# EAGLE schematic io-board-a-1 (EAGLE 8.4.3)
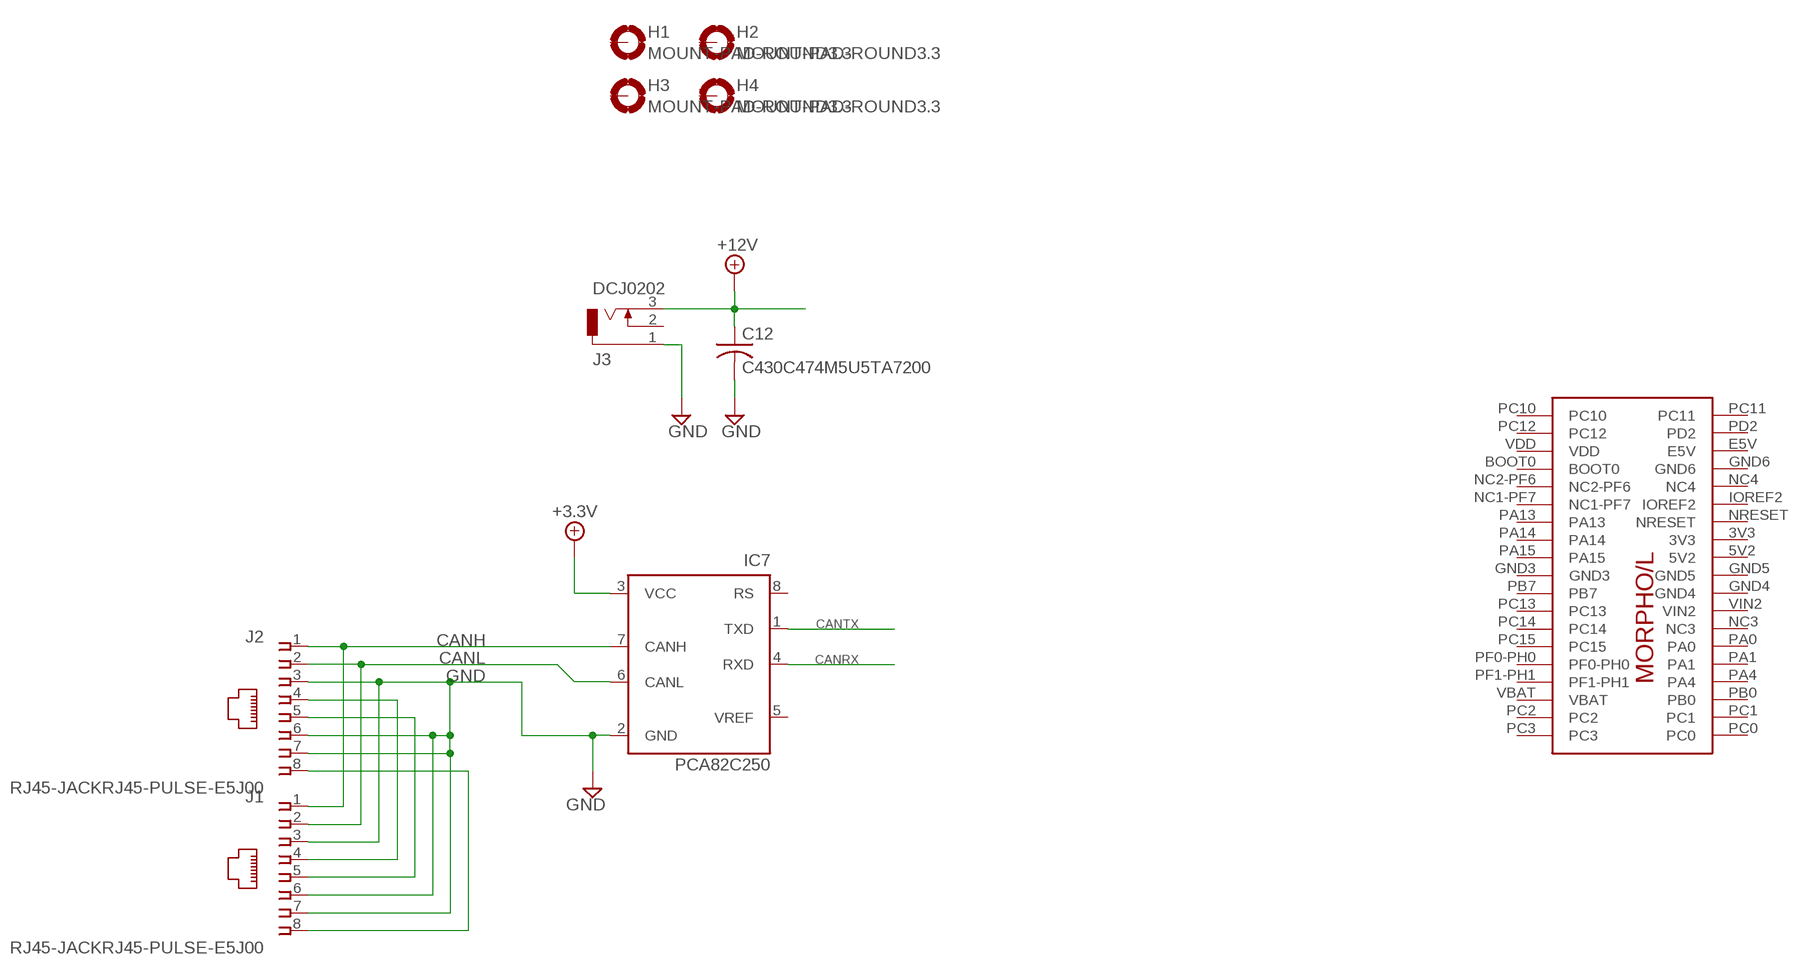
[diagram p0: schematic, sheet 1, part 1 of 2]
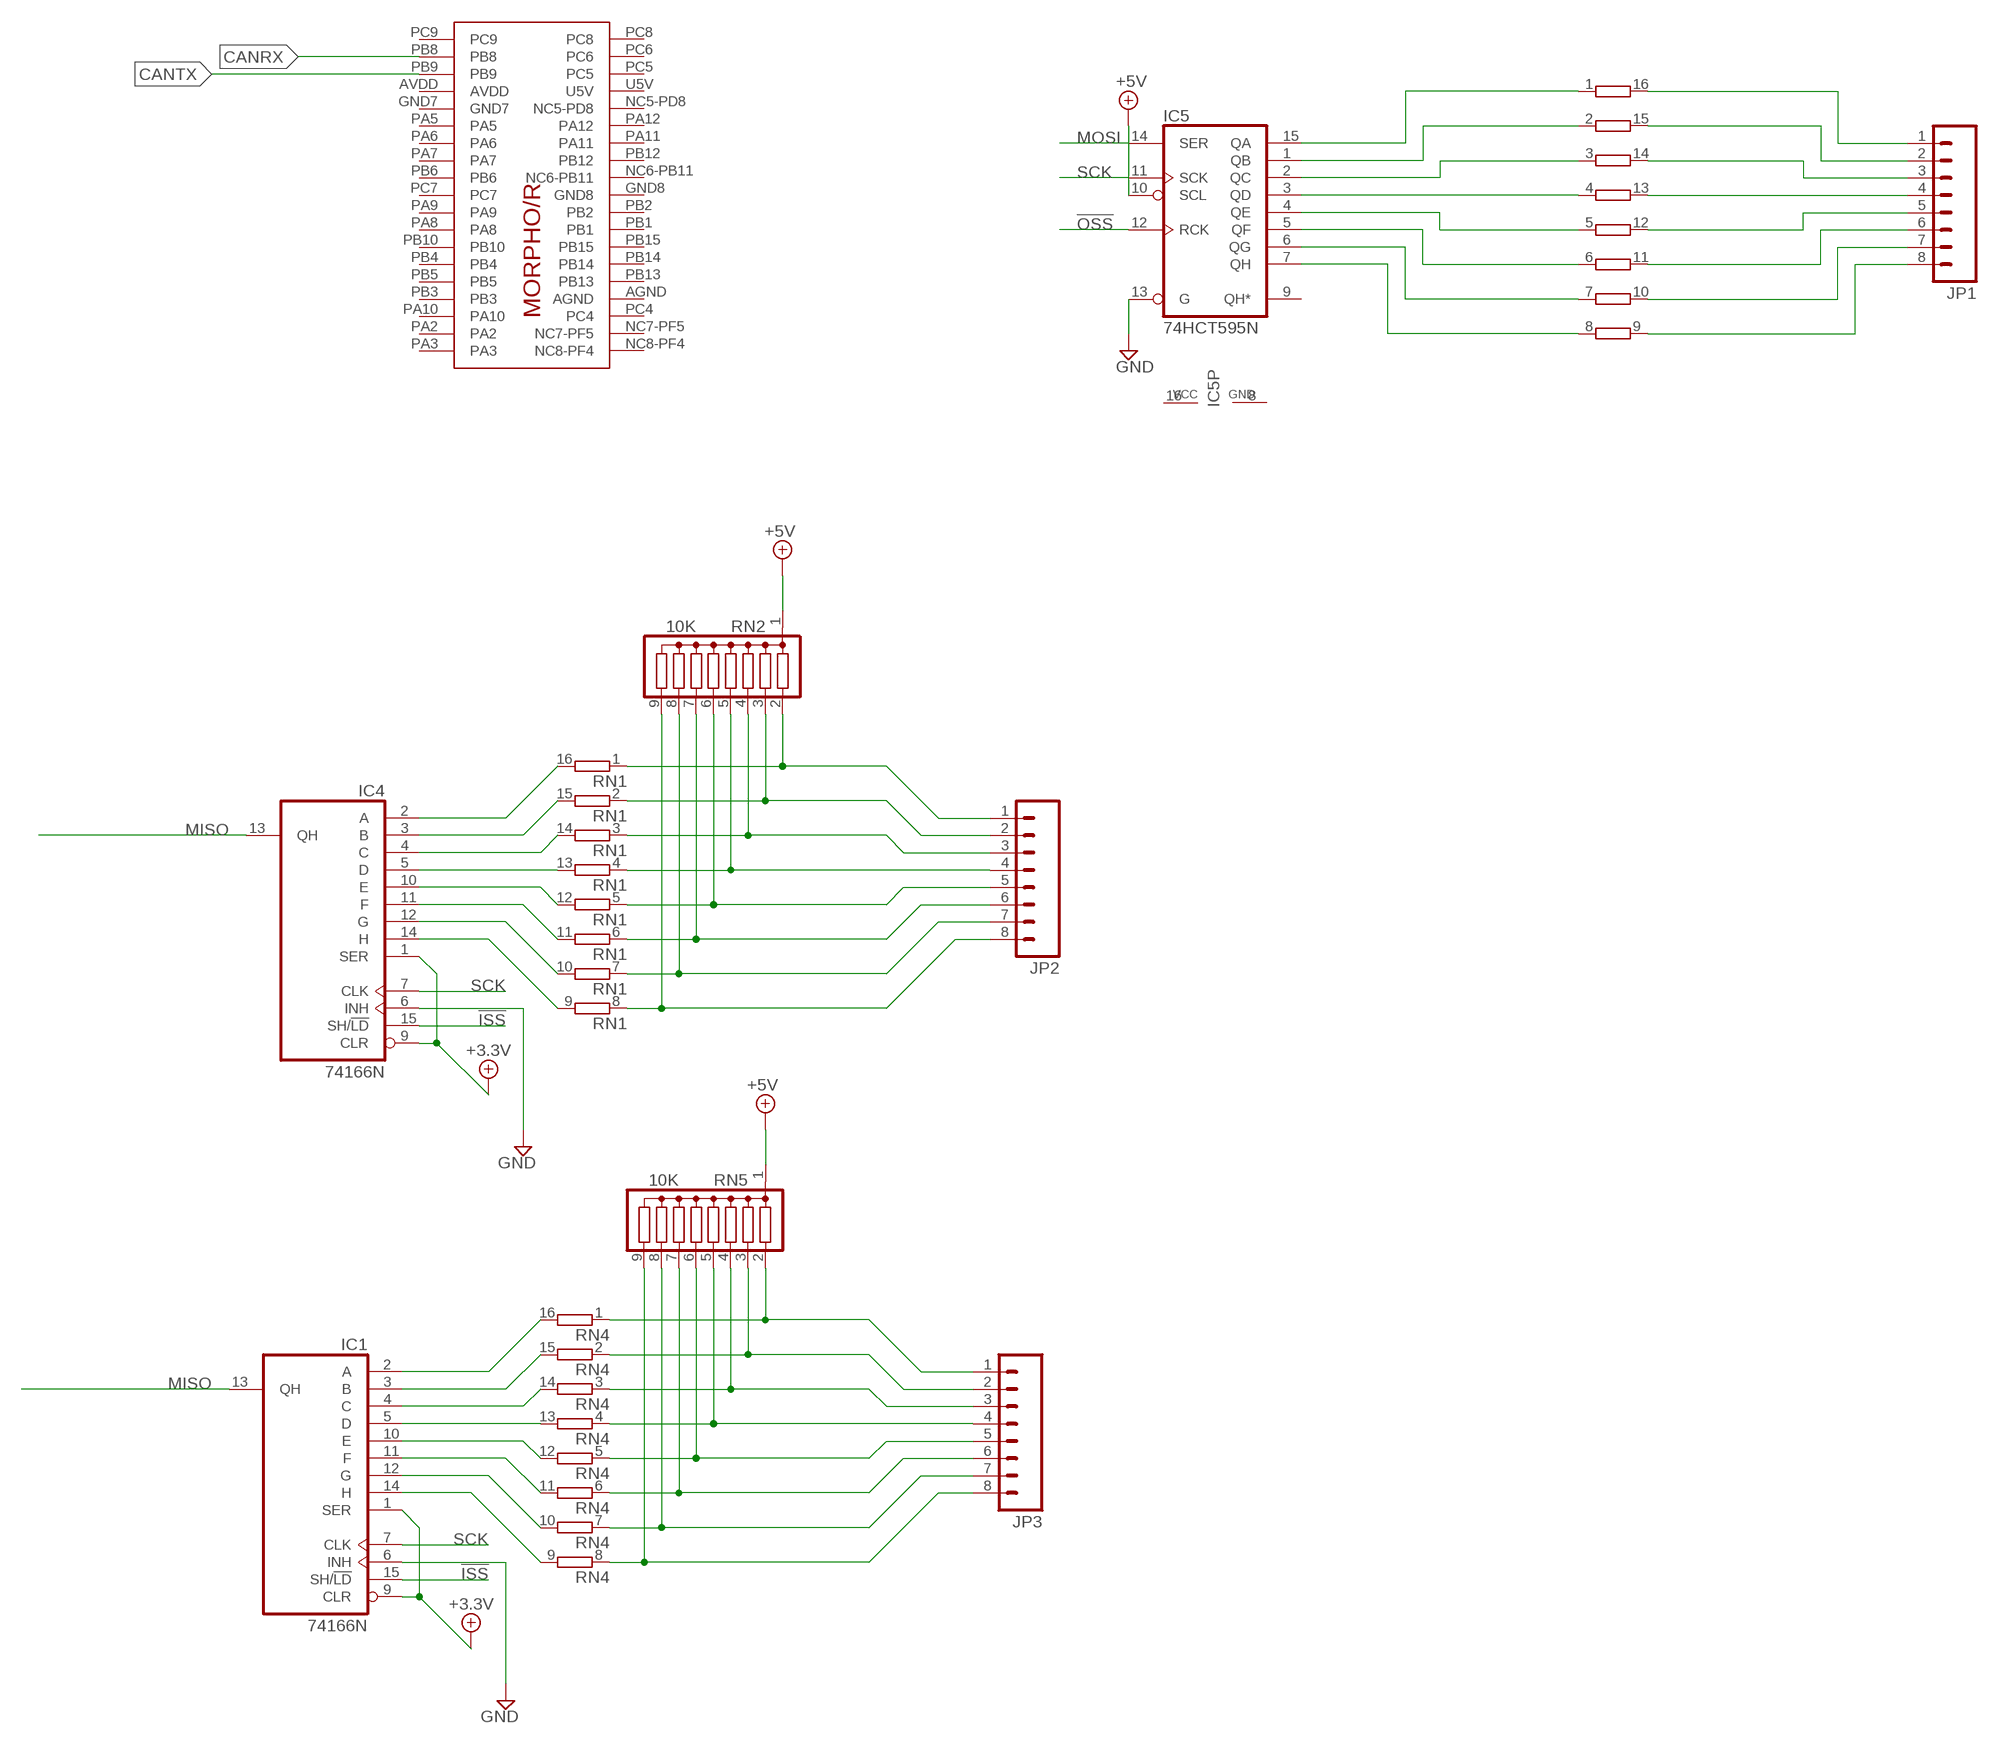
[diagram p1: schematic, sheet 1, part 2 of 2]

## Parts
C12  C430C474M5U5TA7200  C-US075-032X103  [C075-032X103]
H1  MOUNT-PAD-ROUND3.3  [3,3-PAD]
H2  MOUNT-PAD-ROUND3.3  [3,3-PAD]
H3  MOUNT-PAD-ROUND3.3  [3,3-PAD]
H4  MOUNT-PAD-ROUND3.3  [3,3-PAD]
IC1  74166N  [DIL16]
IC4  74166N  [DIL16]
IC5  74HCT595N  [DIL16]
IC7  PCA82C250  [DIL08]
J1  RJ45-JACKRJ45-PULSE-E5J00  [RJ45-PULSE-E5J88]
J2  RJ45-JACKRJ45-PULSE-E5J00  [RJ45-PULSE-E5J88]
J3  DCJ0202  [DCJ0202]
JP1  M08LOCK  [1X08_LOCK]
JP2  M08LOCK  [1X08_LOCK]
JP3  M08LOCK  [1X08_LOCK]
RN1  8R-P  [DIL16]
RN2  10K  G08R  [SIL9]
RN3  8R-P  [DIL16]
RN4  8R-P  [DIL16]
RN5  10K  G08R  [SIL9]
U$1  NUCLEO_64_GENERIC  [NUCLEO_BRD_BASE64]

## Nets
!ISS: IC1.15(SH/!LD) IC4.15(SH/!LD)
!OSS: IC5.12(RCK)
+3.3V: IC1.1(SER) IC1.9(CLR) IC4.1(SER) IC4.9(CLR) IC7.3(VCC)
+5V: IC5.10(SCL) RN2.1 RN5.1
+12V: C12.1 J3.3
CANH: IC7.7(CANH) J1.1 J2.1
CANL: IC7.6(CANL) J1.2 J2.2
CANRX: IC7.4(RXD) U$1.PB8
CANTX: IC7.1(TXD) U$1.PB9
GND: C12.2 IC1.6(INH) IC4.6(INH) IC5.13(G) IC7.2(GND) J1.3 J1.6 J1.7 J2.3 J2.6 J2.7 J3.1
MISO: IC1.13(QH) IC4.13(QH)
MOSI: IC5.14(SER)
N$1: IC5.15(QA) RN3.1
N$2: IC5.1(QB) RN3.2
N$3: IC5.2(QC) RN3.3
N$4: J1.4 J2.4
N$5: J1.5 J2.5
N$6: JP3.1 RN4.1 RN5.2
N$7: IC5.3(QD) RN3.4
N$8: IC5.4(QE) RN3.5
N$9: IC5.5(QF) RN3.6
N$10: IC5.6(QG) RN3.7
N$11: IC5.7(QH) RN3.8
N$12: JP1.1 RN3.16
N$13: JP1.8 RN3.9
N$14: JP3.2 RN4.2 RN5.3
N$15: JP3.3 RN4.3 RN5.4
N$16: JP3.4 RN4.4 RN5.5
N$17: JP1.2 RN3.15
N$18: JP1.3 RN3.14
N$19: JP3.5 RN4.5 RN5.6
N$20: JP3.6 RN4.6 RN5.7
N$21: JP3.7 RN4.7 RN5.8
N$22: JP3.8 RN4.8 RN5.9
N$23: IC1.2(A) RN4.16
N$24: IC1.3(B) RN4.15
N$25: JP2.1 RN1.1 RN2.2
N$26: JP2.2 RN1.2 RN2.3
N$27: JP2.3 RN1.3 RN2.4
N$28: JP2.4 RN1.4 RN2.5
N$29: IC1.4(C) RN4.14
N$30: IC1.5(D) RN4.13
N$31: IC1.10(E) RN4.12
N$32: IC1.11(F) RN4.11
N$33: JP2.5 RN1.5 RN2.6
N$34: JP2.6 RN1.6 RN2.7
N$35: JP2.7 RN1.7 RN2.8
N$36: JP2.8 RN1.8 RN2.9
N$37: IC1.12(G) RN4.10
N$38: IC1.14(H) RN4.9
N$44: IC4.2(A) RN1.16
N$47: IC4.3(B) RN1.15
N$48: IC4.4(C) RN1.14
N$49: IC4.5(D) RN1.13
N$50: IC4.10(E) RN1.12
N$51: IC4.11(F) RN1.11
N$52: IC4.12(G) RN1.10
N$53: IC4.14(H) RN1.9
N$83: JP1.4 RN3.13
N$84: JP1.5 RN3.12
N$85: JP1.6 RN3.11
N$86: JP1.7 RN3.10
PWR_POS: J1.8 J2.8
SCK: IC1.7(CLK) IC4.7(CLK) IC5.11(SCK)
Unconnected: H1.B3,3(MOUNT) H2.B3,3(MOUNT) H3.B3,3(MOUNT) H4.B3,3(MOUNT) IC5.9(QH*) IC7.5(VREF) IC7.8(RS) J3.2 U$1.BOOT0 U$1.IOREF2 U$1.NC1-PF7 U$1.NC2-PF6 U$1.NC3 U$1.NC4 U$1.NC5-PD8 U$1.NC6-PB11 U$1.NC7-PF5 U$1.NC8-PF4 U$1.NRESET U$1.PA0 U$1.PA1 U$1.PA2 U$1.PA3 U$1.PA4 U$1.PA5 U$1.PA6 U$1.PA7 U$1.PA8 U$1.PA9 U$1.PA10 U$1.PA11 U$1.PA12 U$1.PA13 U$1.PA14 U$1.PA15 U$1.PB0 U$1.PB1 U$1.PB2 U$1.PB3 U$1.PB4 U$1.PB5 U$1.PB6 U$1.PB7 U$1.PB10 U$1.PB12 U$1.PB13 U$1.PB14 U$1.PB15 U$1.PC0 U$1.PC1 U$1.PC2 U$1.PC3 U$1.PC4 U$1.PC5 U$1.PC6 U$1.PC7 U$1.PC8 U$1.PC9 U$1.PC10 U$1.PC11 U$1.PC12 U$1.PC13 U$1.PC14 U$1.PC15 U$1.PD2 U$1.PF0-PH0 U$1.PF1-PH1

## Power pins joined to a net without a drawn wire
3V3: U$1.3V3
5V2: U$1.5V2
AGND: U$1.AGND
AVDD: U$1.AVDD
E5V: U$1.E5V
GND: IC1.8(GND) IC4.8(GND) IC5.8(GND)
GND3: U$1.GND3
GND4: U$1.GND4
GND5: U$1.GND5
GND6: U$1.GND6
GND7: U$1.GND7
GND8: U$1.GND8
U5V: U$1.U5V
VBAT: U$1.VBAT
VCC: IC1.16(VCC) IC4.16(VCC) IC5.16(VCC)
VDD: U$1.VDD
VIN2: U$1.VIN2

## Library data of the parts
C12 = rcl:C-US: CAPACITOR, American symbol
H1-H4 = holes:MOUNT-PAD-ROUND: MOUNTING PAD, round
IC1 IC4 = 74xx-us:74*166: 8-bit parallel load SHIFT REGISTER
IC5 = 74xx-eu:74*595: 8-bit SHIFT REGISTER, output latch
IC7 = micro-philips:PCA82C250: CAN CONTROLLER INTERFACE; OC_FARNELL: 3692358; OC_NEWARK: unknown
J1 J2 = trainlib:RJ45-JACK: Mod. Jack, Right Angle, 8 posiotion, 8 contatcs RJ45 Source: GLX-S-88M.pdf
J3 = con-jack:DCJ0202: DC POWER JACK Source: DCJ0202.pdf; OC_FARNELL: unknown; OC_NEWARK: unknown
JP1-JP3 = SPCoast:M08: Header 8 Standard 8-pin 0.1" header. Use with straight break away headers (SKU : PRT-00116), right angle break away headers (PRT-00553), swiss pins (PRT-00743), machine pins (PRT-00117), and female headers (PRT-00115).
RN1 RN3 RN4 = resistor-dil:8R-P: DIL RESISTOR; OC_FARNELL: unknown; OC_NEWARK: unknown
RN2 RN5 = resistor-sil:G08R: SIL RESISTOR; OC_FARNELL: unknown; OC_NEWARK: unknown
U$1 = trainlib:NUCLEO_64_GENERIC